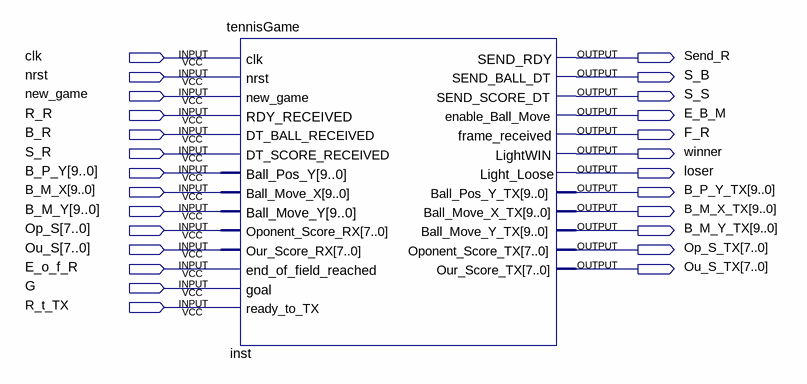
[diagram p0: schematic sheet]
// Quartus schematic Game_Block.bdf as structural Verilog: 1 symbols, 26 pins
module Game_Block (
  input  clk,
  input  nrst,
  input  new_game,
  input  R_R,
  input  B_R,
  input  S_R,
  input  [9:0] B_P_Y,
  input  [9:0] B_M_X,
  input  [9:0] B_M_Y,
  input  [7:0] Op_S,
  input  [7:0] Ou_S,
  input  E_o_f_R,
  input  G,
  input  R_t_TX,
  output Send_R,
  output S_B,
  output S_S,
  output E_B_M,
  output F_R,
  output winner,
  output loser,
  output [9:0] B_P_Y_TX,
  output [9:0] B_M_X_TX,
  output [9:0] B_M_Y_TX,
  output [7:0] Op_S_TX,
  output [7:0] Ou_S_TX
);

  tennisGame inst (
    .clk(clk), .nrst(nrst), .new_game(new_game), .RDY_RECEIVED(R_R), .DT_BALL_RECEIVED(B_R),
    .DT_SCORE_RECEIVED(S_R), .Ball_Pos_Y(B_P_Y), .Ball_Move_X(B_M_X), .Ball_Move_Y(B_M_Y),
    .Oponent_Score_RX(Op_S), .Our_Score_RX(Ou_S), .end_of_field_reached(E_o_f_R), .goal(G),
    .ready_to_TX(R_t_TX), .SEND_RDY(Send_R), .SEND_BALL_DT(S_B), .SEND_SCORE_DT(S_S),
    .enable_Ball_Move(E_B_M), .frame_received(F_R), .LightWIN(winner), .Light_Loose(loser),
    .Ball_Pos_Y_TX(B_P_Y_TX), .Ball_Move_X_TX(B_M_X_TX), .Ball_Move_Y_TX(B_M_Y_TX),
    .Oponent_Score_TX(Op_S_TX), .Our_Score_TX(Ou_S_TX));
endmodule
